# Altium schematic sheet Revision History.SchDoc: Revision History
size 431 x 279 mm; DrawnBy: DD; DocumentNumber: GHL-1-21002; Revision: B; SheetNumber: 7; SheetTotal: 7; ProjectID: 263-03
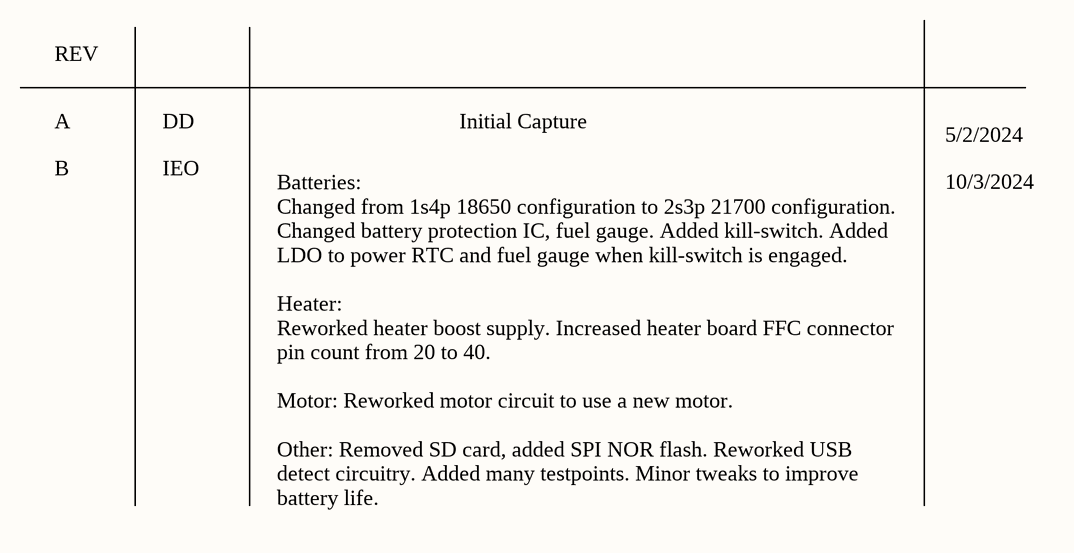
[diagram p0: Revision History.SchDoc]

## Notes on the sheet
- REV
- A
- B
- DD
- IEO
- Initial Capture
- 5/2/2024
- 10/3/2024
- Batteries:
  Changed from 1s4p 18650 configuration to 2s3p 21700 configuration. Changed battery protection IC, fuel gauge. Added kill-switch. Added LDO to power RTC and fuel gauge when kill-switch is engaged.
  Heater:
  Reworked heater boost supply. Increased heater board FFC connector pin count from 20 to 40.
  Motor: Reworked motor circuit to use a new motor.
  Other: Removed SD card, added SPI NOR flash. Reworked USB detect circuitry. Added many testpoints. Minor tweaks to improve battery life.
- REVISION
- DESCRIPTION
- DATE
- APPROVED
- 295 Foster St
- PROJECT
- www.odic.com <http://www.odic.com>
- Littleton, MA
- 01460
- Suite 202
- TITLE
- DRAWN:
- CHECKED:
- APPROVALS
- SIZE
- PROJECT ID
- DWG NO.
- SHEET
- OF
- APPROVED:
- FILE NAME